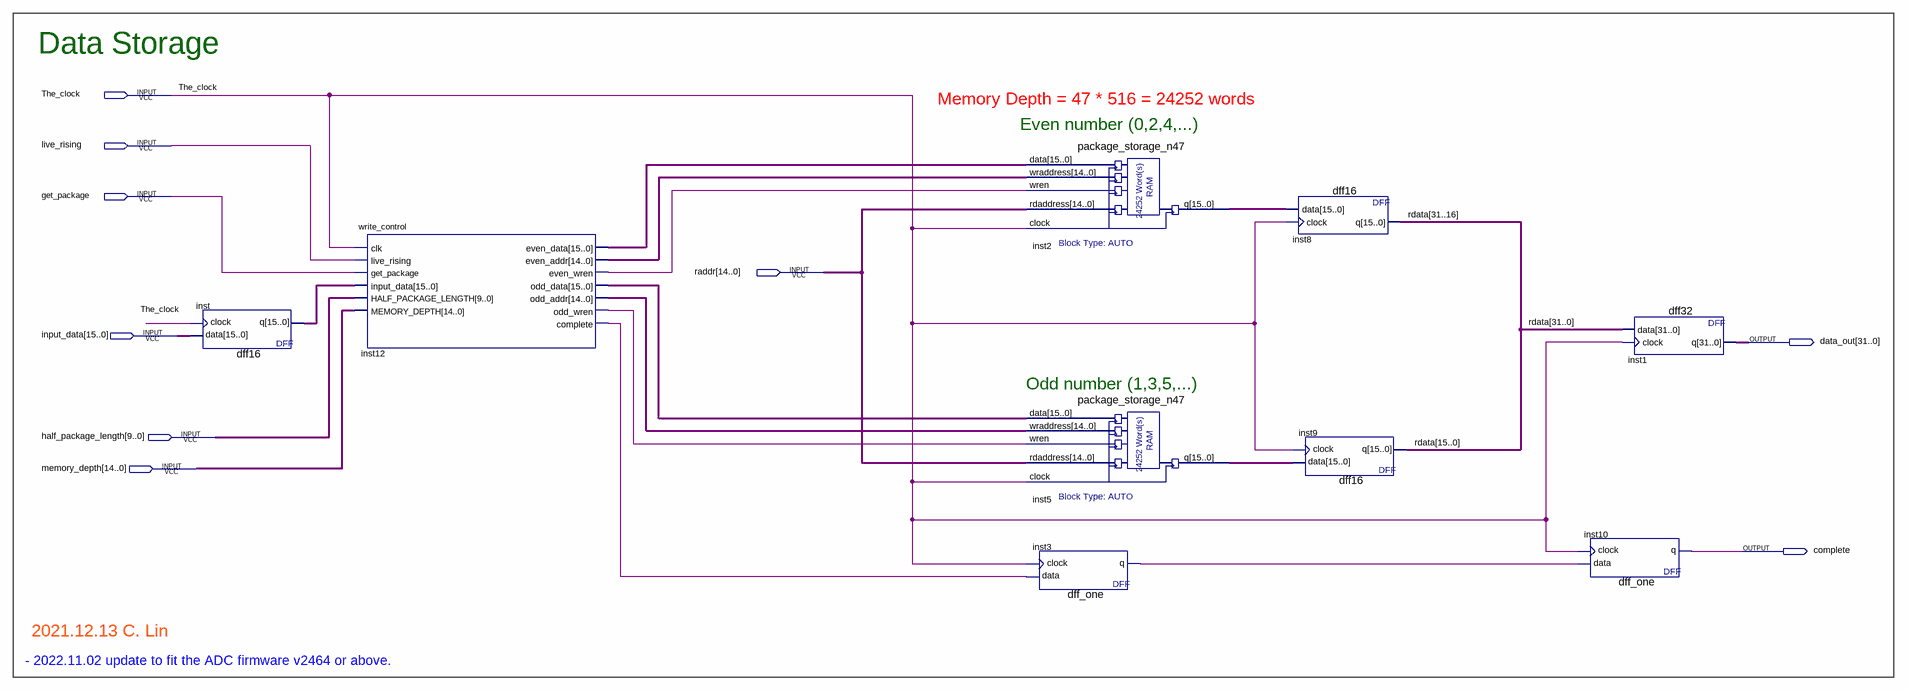
[diagram p0: schematic sheet]
// Quartus schematic data_storage.bdf as structural Verilog: 9 symbols, 9 pins
module data_storage (
  input  The_clock,
  input  live_rising,
  input  get_package,
  input  [14:0] raddr,
  input  [15:0] input_data,
  input  [9:0] half_package_length,
  input  [14:0] memory_depth,
  output [31:0] data_out,
  output complete
);

  wire inst3_q, inst12_complete, inst12_even_wren, inst12_odd_wren;
  wire [14:0] inst12_even_addr, inst12_odd_addr;
  wire [15:0] inst2_q, inst5_q, inst12_even_data, inst12_odd_data, inst_q;
  wire [31:0] rdata;

  dff16 inst (.data(input_data), .clock(The_clock), .q(inst_q));
  write_control inst12 (
    .clk(The_clock), .live_rising(live_rising), .get_package(get_package), .input_data(inst_q),
    .HALF_PACKAGE_LENGTH(half_package_length), .MEMORY_DEPTH(memory_depth), .even_data(inst12_even_data),
    .even_addr(inst12_even_addr), .even_wren(inst12_even_wren), .odd_data(inst12_odd_data),
    .odd_addr(inst12_odd_addr), .odd_wren(inst12_odd_wren), .complete(inst12_complete));
  package_storage_n47 inst2 (
    .data(inst12_even_data), .wraddress(inst12_even_addr), .wren(inst12_even_wren), .rdaddress(raddr),
    .clock(The_clock), .q(inst2_q));
  package_storage_n47 inst5 (
    .data(inst12_odd_data), .wraddress(inst12_odd_addr), .wren(inst12_odd_wren), .rdaddress(raddr),
    .clock(The_clock), .q(inst5_q));
  dff_one inst3 (.data(inst12_complete), .clock(The_clock), .q(inst3_q));
  dff16 inst8 (.data(inst2_q), .clock(The_clock), .q(rdata[31:16]));
  dff16 inst9 (.data(inst5_q), .clock(The_clock), .q(rdata[15:0]));
  dff_one inst10 (.data(inst3_q), .clock(The_clock), .q(complete));
  dff32 inst1 (.data(rdata), .clock(The_clock), .q(data_out));

  // Notes on the sheet:
  //   Data Storage
  //   Memory Depth = 47 * 516 = 24252 words
  //   Even number (0,2,4,...)
  //   Odd number (1,3,5,...)
  //   2021.12.13 C. Lin
  //   - 2022.11.02 update to fit the ADC firmware v2464 or above.
endmodule
